# EAGLE design USBReallyTinyISPv1 (EAGLE 6.1)
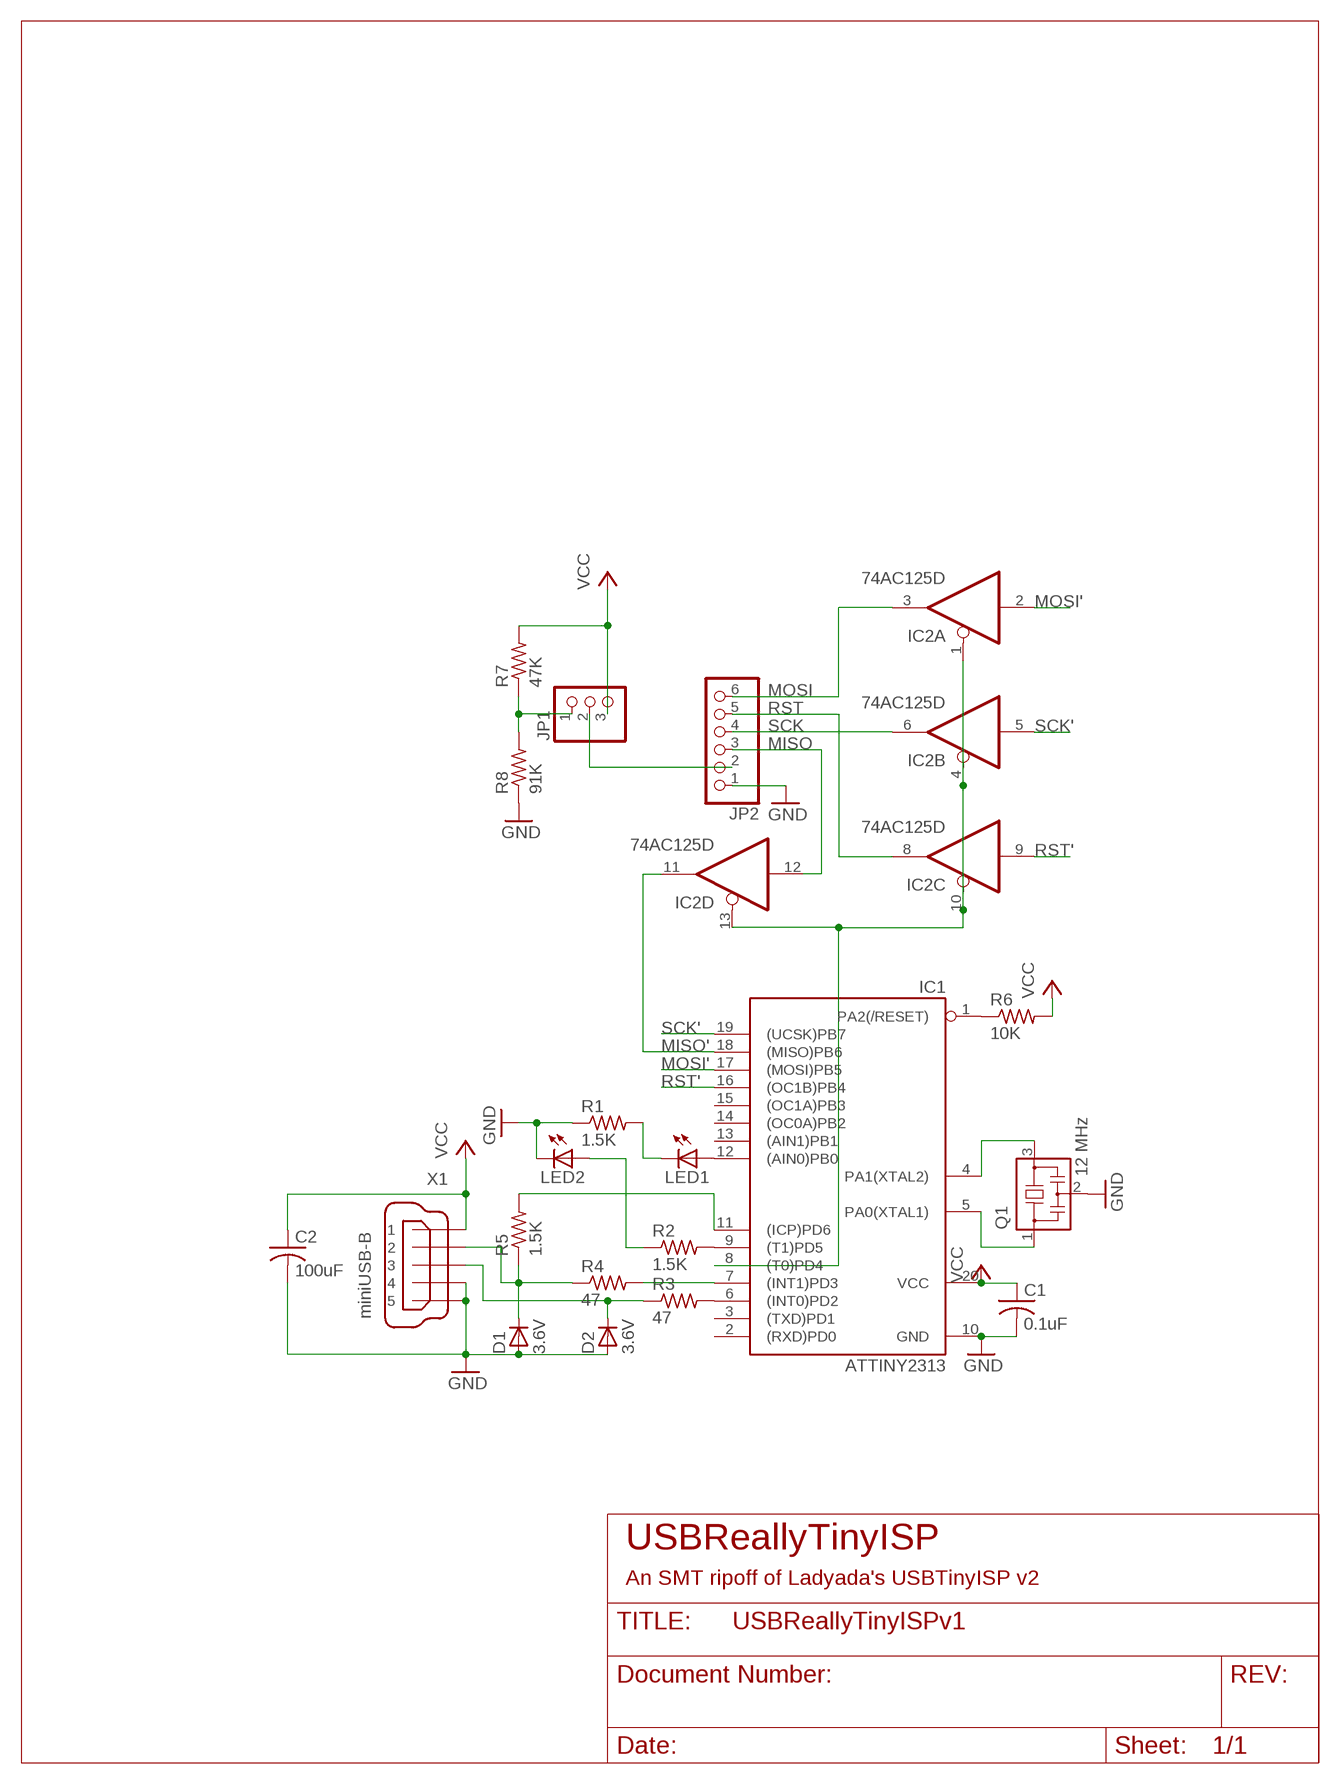
[diagram p0: schematic, sheet 1]

## Parts
C1  0.1uF  C-USC0805  [C0805]
C2  100uF  C-USC1206  [C1206]
D1  3.6V  DIODE_SOD-123  [SOD3718X135N]
D2  3.6V  DIODE_SOD-123  [SOD3718X135N]
IC1  ATTINY2313  TINY2313-*S*  [SO20L$]
IC2  74AC125D  [SO14]
JP1  PINHD-1X3  [1X03]
JP2  PINHD-1X6  [1X06]
LED1  LEDSML0805  [SML0805]
LED2  LEDSML0805  [SML0805]
Q1  12 MHz  CSTCR6M00G53Z  [CSTCR6M]
R1  1.5K  R-US_R0805  [R0805]
R2  1.5K  R-US_R0805  [R0805]
R3  47  R-US_R0805  [R0805]
R4  47  R-US_R0805  [R0805]
R5  1.5K  R-US_R0805  [R0805]
R6  10K  R-US_R0805  [R0805]
R7  47K  R-US_R0805  [R0805]
R8  91K  R-US_R0805  [R0805]
X1  miniUSB-B  MINI-USB-UX60A-MB-5ST  [UX60A-MB-5ST]

## Nets
GND: C1.2 C2.2 D1.A D2.A IC1.10(GND) JP2.1 LED2.C Q1.2 R1.1 R8.1 X1.4 X1.5
MISO: IC2.12(D:I) JP2.3
MISO': IC1.18((MISO)PB6) IC2.11(D:O)
MOSI: IC2.3(A:O) JP2.6
MOSI': IC1.17((MOSI)PB5) IC2.2(A:I)
N$1: IC1.12((AIN0)PB0) LED1.A
N$2: IC1.4(PA1(XTAL2)) Q1.3
N$3: IC1.5(PA0(XTAL1)) Q1.1
N$4: IC1.1(PA2(/RESET)) R6.1
N$5: IC1.9((T1)PD5) R2.2
N$6: LED2.A R2.1
N$7: LED1.C R1.2
N$8: IC1.6((INT0)PD2) R3.2
N$9: IC1.7((INT1)PD3) R4.2
N$10: D2.K R3.1 X1.3
N$11: D1.K R4.1 R5.1 X1.2
N$12: IC1.8((T0)PD4) IC2.1(A:OE) IC2.4(B:OE) IC2.10(C:OE) IC2.13(D:OE)
N$13: JP1.2 JP2.2
N$14: IC1.11((ICP)PD6) R5.2
N$15: JP1.1 R7.1 R8.2
RST: IC2.8(C:O) JP2.5
RST': IC1.16((OC1B)PB4) IC2.9(C:I)
SCK: IC2.6(B:O) JP2.4
SCK': IC1.19((UCSK)PB7) IC2.5(B:I)
VCC: C1.1 C2.1 IC1.20(VCC) JP1.3 R6.2 R7.2 X1.1
Unconnected: IC1.2((RXD)PD0) IC1.3((TXD)PD1) IC1.13((AIN1)PB1) IC1.14((OC0A)PB2) IC1.15((OC1A)PB3)

## Notes on the sheet
- USBReallyTinyISP
- An SMT ripoff of Ladyada's USBTinyISP v2

## Power pins joined to a net without a drawn wire
GND: IC2.7(P:GND)
VCC: IC2.14(P:VCC)

## Library data of the parts
C1 = adafruit:C-US: CAPACITOR, American symbol
C2 = resistor:C-US: CAPACITOR, American symbol
D1 D2 = ipc-7351-diode:DIODE_
IC1 = avr-7:TINY2313*: Atmel Tiny2313 2K Flash, 128 bytes EEPROM, 128 bytes RAM
IC2 = 74xx-eu:74*125: Quad bus BUFFER, 3-state
JP1 = adafruit:PINHD-1X3: PIN HEADER
JP2 = adafruit:PINHD-1X6: PIN HEADER
LED1 LED2 = led:LED: LED OSRAM: - CHIPLED LG R971, LG N971, LY N971, LG Q971, LY Q971, LO R971, LY R971 LH N974, LH R974 LS Q976, LO Q976, LY Q976 LO Q996 - Hyper CHIPLED LW Q18S LB Q993, LB Q99A, LB R99A - SideLED LS A670, LO A670, LY A670, LG A670, LP A670 LB A673, LV A673, LT A673, LW A673 LH A674 LY A675 LS A676, LA A676, LO A676, LY A676, LW A676 LS A679, LY A679, LG A679 - Hyper Micro SIDELED® LS Y876, LA Y876, LO Y876, LY Y876 LT Y87S - SmartLED LW L88C, LW L88S LB L89C, LB L89S, LG L890 LS L89K, LO L89K, LY L89K LS L896, LA L896, LO L896, LY L896 - TOPLED LS T670, LO T670, LY T670, LG T670, LP T670 LSG T670, LSP T670, LSY T670, LOP T670, LYG T670 LG T671, LOG T671, LSG T671 LB T673, LV T673, LT T673, LW T673 LH T674 LS T676, LA T676, LO T676, LY T676, LB T676, LH T676, LSB T676, LW T676 LB T67C, LV T67C, LT T67C, LS T67K, LO T67K, LY T67K, LW E67C LS E67B, LA E67B, LO E67B, LY E67B, LB E67C, LV E67C, LT E67C LW T67C LS T679, LY T679, LG T679 LS T770, LO T770, LY T770, LG T770, LP T770 LB T773, LV T773, LT T773, LW T773 LH T774 LS E675, LA E675, LY E675, LS T675 LS T776, LA T776, LO T776, LY T776, LB T776 LHGB T686 LT T68C, LB T68C - Hyper Mini TOPLED® LB M676 - Mini TOPLED Santana® LG M470 LS M47K, LO M47K, LY M47K Source: http://www.osram.convergy.de LUXEON: - LUMILED® LXK2-PW12-R00, LXK2-PW12-S00, LXK2-PW14-U00, LXK2-PW14-V00 LXK2-PM12-R00, LXK2-PM12-S00, LXK2-PM14-U00 LXK2-PE12-Q00, LXK2-PE12-R00, LXK2-PE12-S00, LXK2-PE14-T00, LXK2-PE14-U00 LXK2-PB12-K00, LXK2-PB12-L00, LXK2-PB12-M00, LXK2-PB14-N00, LXK2-PB14-P00, LXK2-PB14-Q00 LXK2-PR12-L00, LXK2-PR12-M00, LXK2-PR14-Q00, LXK2-PR14-R00 LXK2-PD12-Q00, LXK2-PD12-R00, LXK2-PD12-S00 LXK2-PH12-R00, LXK2-PH12-S00 LXK2-PL12-P00, LXK2-PL12-Q00, LXK2-PL12-R00 Source: www.luxeon.com KINGBRIGHT: KA-3528ASYC Source: www.kingbright.com
Q1 = murata-filter:CSTCR: Resonator Source: murata.co.jp; MPN: CSTCR6M00G53-R0; OC_FARNELL: 1170434; OC_NEWARK: 25M8759
R1-R8 = resistor:R-US_: RESISTOR, American symbol
X1 = con-hirose:MINI-USB-: MINI USB Connector Source: http://www.hirose.co.jp/cataloge_hp/e24000019.pdf; OC_FARNELL: unknown; OC_NEWARK: unknown

## Board
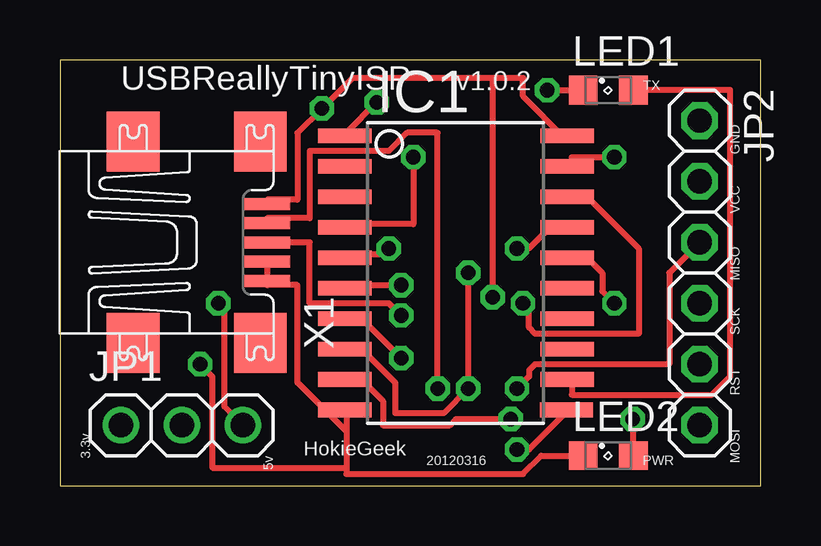
[diagram p1: board, top side]
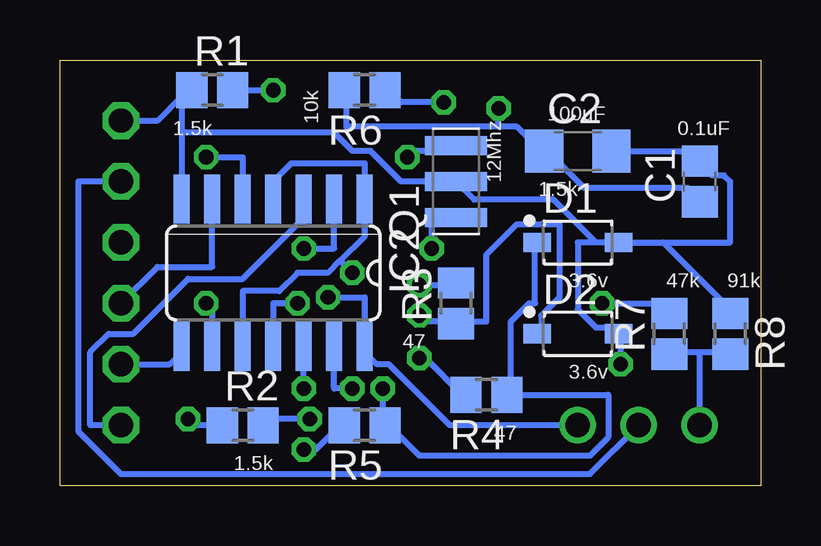
[diagram p2: board, bottom side, seen from below]

Size 29.21 x 17.77 mm. Coordinates in mm from the lower left corner, seen from the top.
Outline: 0,0 29.21,0 29.21,17.77 0,17.77 0,0
Copper layers (1*16): Top 0.035mm / dielectric 1.5mm / Bottom 0.035mm
Design rules: minimum track width 10mil, minimum drill 24mil, track to track 8mil, track to pad 8mil, pad to pad 8mil, via to via 8mil, smd to smd 8mil, copper to edge 10mil, drill to drill 8mil, minimum pad ring 10mil, minimum via ring 8mil, stop-mask expansion 4mil, vias tented up to drill 0mil, thermal gap 10mil

### Footprints (pad centres in the part's own frame; a part is rotated, then mirrored left to right if it is on the bottom)
C0805 = smd 1.3 x 1.5: 1 -0.85,0; 2 0.85,0
C1206 = smd 1.6 x 1.8: 1 -1.4,0; 2 1.4,0
SOD3718X135N = smd 1.15 x 0.8: A 1.7,0; K -1.7,0
SO20L$ = smd 0.61 x 2.21: 1 -5.715,-4.636; 2 -4.445,-4.636; 3 -3.175,-4.636; 4 -1.905,-4.636; 5 -0.635,-4.636; 6 0.635,-4.636; 7 1.905,-4.636; 8 3.175,-4.636; 9 4.445,-4.636; 10 5.715,-4.636; 11 5.715,4.61; 12 4.445,4.636; 13 3.175,4.636; 14 1.905,4.636; 15 0.635,4.636; 16 -0.635,4.636; 17 -1.905,4.636; 18 -3.175,4.636; 19 -4.445,4.636; 20 -5.715,4.636
SO14 = smd 0.66 x 2.032: 1 -3.81,-3.073; 2 -2.54,-3.073; 3 -1.27,-3.073; 4 0,-3.073; 5 1.27,-3.073; 6 2.54,-3.073; 7 3.81,-3.073; 8 3.81,3.073; 9 2.54,3.073; 10 1.27,3.073; 11 0,3.073; 12 -1.27,3.073; 13 -2.54,3.073; 14 -3.81,3.073
1X03 = drill 1.016: 1 -2.54,0; 2 0,0; 3 2.54,0
1X06 = drill 1.016 octagon: 1 -6.35,0; 2 -3.81,0; 3 -1.27,0; 4 1.27,0; 5 3.81,0; 6 6.35,0
SML0805 = smd 1.2 x 1.2: A 1.05,0; C -1.05,0
CSTCR6M = smd 0.8 x 2.6: 1 -1.5,0; 2 0,0; 3 1.5,0
R0805 = smd 1.3 x 1.5: 1 -0.85,0; 2 0.85,0
UX60A-MB-5ST = smd 2 x 0.5: 1 2.25,1.6; 2 2.25,0.8; 3 2.25,0; 4 2.25,-0.8; 5 2.25,-1.6 | smd 2.2 x 2.5: M1 -3.3,-4.2; M2 -3.3,4.2; M3 2,4.2; M4 2,-4.2

### Placement (x,y rotation side)
C1  2.54,12.7 90 bottom
C2  7.62,13.97 0 bottom
D1  7.62,10.16 0 bottom
D2  7.62,6.35 0 bottom
IC1  16.51,8.89 270 top
IC2  20.32,8.89 180 bottom
JP1  5.08,2.54 0 top
JP2  26.67,8.89 270 top
LED1  22.86,16.51 0 top
LED2  22.86,1.27 0 top
Q1  12.7,12.7 90 bottom
R1  22.86,16.51 0 bottom
R2  21.59,2.54 0 bottom
R3  12.7,7.62 90 bottom
R4  11.43,3.81 180 bottom
R5  16.51,2.54 180 bottom
R6  16.51,16.51 180 bottom
R7  3.81,6.35 90 bottom
R8  1.27,6.35 270 bottom
X1  6.35,10.16 0 top

### Tracks (layer width: path | path; a pad name or v marks a point on that pad's centre or on a via)
GND  (via drill 0.61)
  Top 0.254: X1.4 8.64,9.14 8.64,8.64 X1.5 8.64,8.38 9.91,8.38 9.91,4.32 11.94,2.29 | LED2.C 20.07,1.27 19.3,0.51 11.94,0.51 11.94,0.76 | 11.94,2.29 11.94,3.05 IC1.10 | 11.94,2.29 11.94,0.76 | 11.94,0.76 6.35,0.76 6.35,4.57 v5.84,5.08
  Bottom 0.254: 24.13,16.26 25.15,15.24 JP2.1 | 24.13,16.26 23.88,16.51 R1.1 24.13,16.26 | 24.13,16.26 24.13,14.73 | 24.13,14.73 IC2.7 | C2.2 2.79,13.97 2.54,13.72 C1.2 2.54,13.46 2.03,12.95 1.52,12.95 1.27,12.7 1.27,10.16 4.06,10.16 | 6.86,10.16 D1.A 4.06,10.16 | 6.86,10.16 7.62,10.16 7.62,7.37 6.86,6.6 6.35,6.6 6.1,6.35 D2.A 5.84,6.35 v5.84,5.08 | 4.06,10.16 1.27,7.37 R8.1 | 6.86,10.16 8.64,11.94 11.94,11.94 Q1.2 14.99,12.7 16.26,13.97 17.02,13.97 17.78,14.73 24.13,14.73
MISO  (via drill 0.61)
  Top 0.254: v19.05,4.06 19.56,4.57 19.56,4.83 19.81,5.08 25.4,5.08 25.4,8.89 JP2.3
  Bottom 0.254: v19.05,4.06 IC2.12
MISO'  (via drill 0.61)
  Top 0.254: v19.3,7.62 19.56,7.37 19.56,6.6 19.81,6.35 24.13,6.35 24.13,9.91 22.1,11.94 21.34,11.94 IC1.18
  Bottom 0.254: IC2.11 20.32,7.62 v19.3,7.62
MOSI
  Bottom 0.254: IC2.3 19.05,10.92 19.3,10.92 21.59,8.64 23.88,8.64 26.16,6.35 27.18,6.35 27.94,5.59 27.94,2.54 JP2.6
MOSI'  (via drill 0.61)
  Top 0.254: v19.05,9.91 19.56,9.91 20.32,10.67 21.08,10.67 IC1.17
  Bottom 0.254: IC2.2 17.78,9.91 v19.05,9.91
N$1
  Top 0.254: LED1.A 27.94,16.51 27.94,4.57 27.18,3.81 21.34,3.81 21.34,4.32 IC1.12
N$2  (via drill 0.61)
  Top 0.254: v14.73,13.72 14.73,10.92 11.94,10.92 IC1.4
  Bottom 0.254: v14.73,13.72 14.48,13.97 12.7,13.97 Q1.3
N$3  (via drill 0.61)
  Top 0.254: v13.72,9.91 13.72,9.65 11.94,9.65 IC1.5
  Bottom 0.254: v13.72,9.91 13.72,11.18 12.7,11.18 Q1.1
N$4  (via drill 0.61)
  Top 0.254: v13.21,16 11.94,14.73 IC1.1
  Bottom 0.254: v13.21,16 14.99,16 15.49,16.51 R6.1
N$5  (via drill 0.61)
  Top 0.254: v18.8,2.79 16.51,2.79 16.26,2.54 13.46,2.54 13.46,3.56 12.7,4.32 11.94,4.32 IC1.9
  Bottom 0.254: v18.8,2.79 20.32,2.79 20.57,2.54 R2.2
N$6  (via drill 0.61)
  Top 0.254: v23.88,2.79 23.88,1.27 LED2.A
  Bottom 0.254: v23.88,2.79 23.62,2.54 R2.1
N$7  (via drill 0.61)
  Top 0.254: v20.32,16.51 LED1.C
  Bottom 0.254: R1.2 v20.32,16.51
N$8  (via drill 0.61)
  Top 0.254: v14.22,8.38 11.94,8.38 IC1.6
  Bottom 0.254: v14.22,8.38 12.7,8.38 R3.2
N$9  (via drill 0.61)
  Top 0.254: v14.22,5.33 12.7,6.86 11.94,6.86 IC1.7
  Bottom 0.254: v14.22,5.33 13.97,5.33 12.45,3.81 R4.2
N$10  (via drill 0.61)
  Top 0.254: X1.3 10.41,10.16 10.41,7.62 13.72,7.62 v14.22,7.11
  Bottom 0.254: 12.7,6.86 11.43,6.86 11.43,9.65 10.16,10.92 8.38,10.92 8.38,7.87 9.14,7.11 9.14,6.35 D2.K | v14.22,7.11 13.97,6.86 12.7,6.86 | 12.7,6.86 R3.1
N$11  (via drill 0.61)
  Top 0.254: v15.75,4.06 15.75,14.73 14.48,14.73 13.72,13.97 10.41,13.97 10.41,11.18 8.64,11.18 X1.2
  Bottom 0.254: 10.41,3.81 10.41,6.86 9.65,7.62 9.4,7.62 9.4,10.16 D1.K | 10.41,3.81 6.35,3.81 6.35,2.03 7.11,1.27 14.22,1.27 15.49,2.54 R5.1 15.75,2.54 v15.75,4.06 | 10.41,3.81 R4.1
N$12  (via drill 0.61)
  Top 0.254: IC1.8 11.94,5.59 12.7,5.59 13.97,4.32 13.97,3.05 16,3.05 v17.02,4.06 v17.02,8.89
  Bottom 0.254: IC2.13 17.78,4.06 v17.02,4.06 | IC2.4 20.32,12.7 19.56,13.46 16.51,13.46 IC2.1 16.51,10.41 17.53,9.4 | IC2.10 21.59,8.13 20.07,8.13 19.3,8.89 18.03,8.89 17.53,9.4 | 17.53,9.4 v17.02,8.89
N$13
  Bottom 0.254: JP1.2 7.11,0.51 26.67,0.51 28.45,2.29 28.45,12.7 JP2.2
N$14  (via drill 0.61)
  Top 0.254: v19.05,1.52 19.56,1.52 21.08,3.05 IC1.11
  Bottom 0.254: v19.05,1.52 18.54,1.52 17.53,2.54 R5.2
N$15
  Bottom 0.254: 2.54,5.59 3.81,5.59 R7.1 | 2.54,5.59 1.27,5.59 R8.2 | JP1.1 2.54,5.59
RST
  Bottom 0.254: JP2.5 24.64,5.08 24.13,5.59 IC2.8
RST'  (via drill 0.61)
  Top 0.254: v23.11,7.62 22.61,8.13 22.61,8.89 22.1,9.4 21.34,9.4 IC1.16
  Bottom 0.254: IC2.9 22.86,7.62 v23.11,7.62
SCK
  Bottom 0.254: IC2.6 22.86,9.14 25.15,9.14 JP2.4
SCK'  (via drill 0.61)
  Top 0.254: v23.11,13.72 21.34,13.72 21.34,13.46 IC1.19
  Bottom 0.254: IC2.5 21.59,13.72 v23.11,13.72
VCC  (via drill 0.61)
  Top 0.254: v6.6,7.62 6.86,7.37 6.86,3.3 JP1.3 | 18.03,17.02 19.3,17.02 19.3,16.26 21.08,14.48 IC1.20 | 18.03,17.02 12.19,17.02 v10.92,15.75 9.91,14.73 9.91,11.94 8.64,11.94 X1.1 | 18.03,17.02 v18.03,7.87
  Bottom 0.254: v6.6,7.62 4.06,7.62 3.81,7.37 R7.2 | JP1.3 12.95,2.54 15.49,5.08 16,5.08 16.51,5.59 IC2.14 16.51,7.87 v18.03,7.87 | C1.1 2.54,11.94 3.05,12.45 7.37,12.45 8.89,13.97 C2.1 9.14,13.97 10.16,14.99 10.92,14.99 | 10.92,14.99 17.27,14.99 17.27,16.51 R6.2 | 10.92,14.99 v10.92,15.75

### Text on the board
tPlace: USBReallyTinyISP | v1.0.2 | TX | GND | VCC | MISO | SCK | RST | 3.3v | MOSI | 5v | HokieGeek | 20120316 | PWR
bPlace: 10k | 0.1uF | 100uF | 12Mhz | 1.5k | 1.5k | 91k | 47k | 3.6v | 47 | 3.6v | 47 | 1.5k